# Altium schematic sheet pcb_clk.SchDoc
size 228 x 114 mm; SheetNumber: 4; SheetTotal: 13
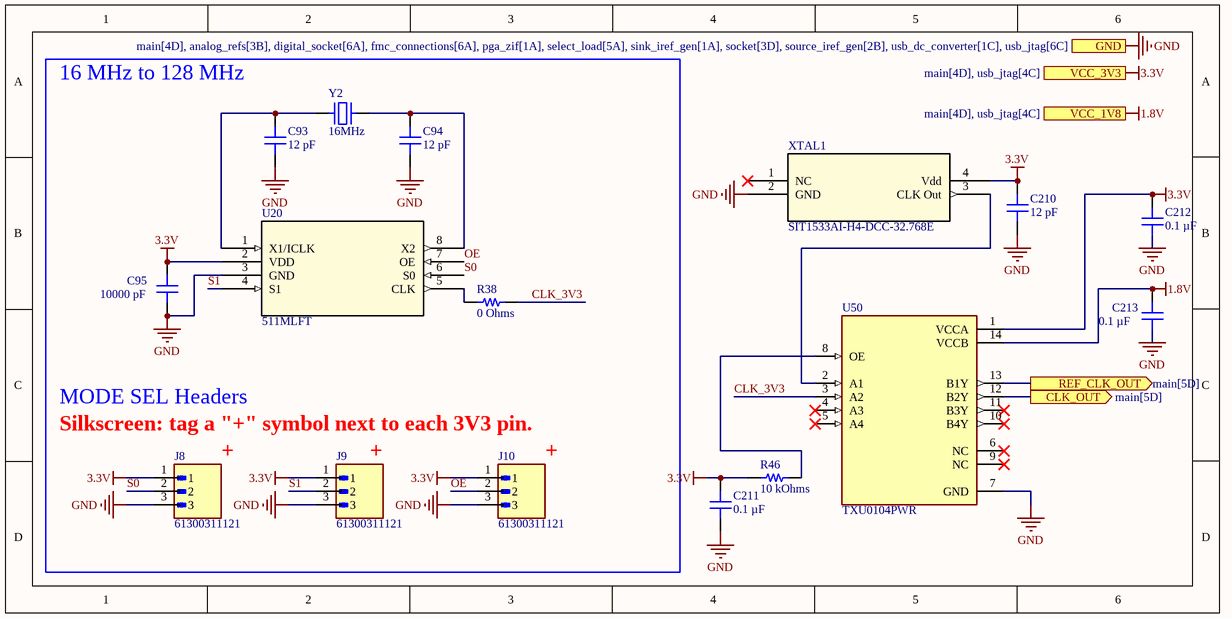
[diagram p0: pcb_clk.SchDoc]

## Parts
C93  12 pF  [CAP 0805_2012]
C94  12 pF  [CAP 0805_2012]
C95  10000 pF  [CAP 0805_2012]
C210  12 pF  [CAP 0805_2012]
C211  0.1 µF  [CAP 0805_2012]
C212  0.1 µF  [CAP 0805_2012]
C213  0.1 µF  [CAP 0805_2012]
J8  61300311121  [WURTH_61300311121]
J9  61300311121  [WURTH_61300311121]
J10  61300311121  [WURTH_61300311121]
R38  0 Ohms  [RES 0805_2012]
R46  10 kOhms  [RES 0805_2012]
U20  511MLFT  [SOIC8_150MIL_REN]
U50  TXU0104PWR  [SOP65P640X120-14N]
XTAL1  SIT1533AI-H4-DCC-32.768E  [XTAL4_SiT1533_SIT]
Y2  16MHz  [TXC 9C]

## Ports
CLK_OUT (out, see main[5D]), GND (see main[4D], analog_refs[3B], digital_socket[6A], fmc_connections[6A], pga_zif[1A], select_load[5A], sink_iref_gen[1A], socket[3D], source_iref_gen[2B], usb_dc_converter[1C], usb_jtag[6C]), REF_CLK_OUT (out, see main[5D]), VCC_1V8 (see main[4D], usb_jtag[4C]), VCC_3V3 (see main[4D], usb_jtag[4C])

## Nets
1.8V: C213.2 U50.14(VCCB) ; port VCC_1V8
3.3V: C95.2 C210.2 C211.2 C212.2 J8.1 J9.1 J10.1 R46.1 U20.2(VDD) U50.1(VCCA) XTAL1.4(Vdd) ; port VCC_3V3
GND: C93.1 C94.1 C95.1 C210.1 C211.1 C212.1 C213.1 J8.3 J9.3 J10.3 U20.3(GND) U50.7(GND) XTAL1.2(GND) ; port GND
CLK_3V3: R38.2 U50.3(A2)
CLK_OUT: U50.12(B2Y) ; port CLK_OUT
OE: J10.2 U20.7(OE)
REF_CLK_OUT: U50.13(B1Y) ; port REF_CLK_OUT
S0: J8.2 U20.6(S0)
S1: J9.2 U20.4(S1)
NetC93_2: C93.2 U20.1(X1/ICLK) Y2.1
NetC94_2: C94.2 U20.8(X2) Y2.2
NetR38_1: R38.1 U20.5(CLK)
NetR46_2: R46.2 U50.8(OE)
NetU50_2: U50.2(A1) XTAL1.3(CLK_Out)

Not connected (* = marked no-connect by the designer): U50 4(A3)* 5(A4)* 6(NC)* 9(NC)* 10(B4Y)* 11(B3Y)*; XTAL1 1(NC)*

## Notes on the sheet
- (near C93) 16 MHz to 128 MHz
- MODE SEL Headers
- Silkscreen: tag a "+" symbol next to each 3V3 pin.
- (near J8) +
- (near J9) +
- (near J10) +

## Library data of the parts
C93 C94 C210 = 251R15S120GV4E: CAP CER 12PF 250V NP0 0805; manufacturer: Johanson Technology Inc.; Temperature Coefficient: C0G, NP0; Tolerance: ±2%; Part Number: 251R15S120GV4E; Capacitance: 12 pF; Applications: RF, Microwave, High Frequency; componentlink1description: Datasheet; componentlink1url: https://www.johansontechnology.com/downloads/catalog/johanson-technology-multi-layer-high-q-capacitors.pdf; componentlink2description: DigiKey Link; componentlink2url: https://www.digikey.com/en/products/detail/johanson-technology-inc/251R15S120GV4E/1919438; Device Package: 0805 (2012 Metric); Features: High Q, Low Loss, Ultra Low ESR; lastupdated: 4/6/2026 7:32:26 PM; Lifecycle Status: Active; Minimum Order: 1; Mounting Type: Surface Mount, MLCC; Operating Temperature: -55°C ~ 125°C; Package / Case: 0805 (2012 Metric); packaging: TapeAndReel; partid: 16409; Part Status: Active; price: 0.13; series: S; Size / Dimension: 0.080" L x 0.050" W (2.03mm x 1.27mm); Supplier 1: DigiKey; Supplier Part Number 1: 712-1722-1-ND; Thickness (Max): 0.046" (1.17mm); value: 12 pF; Voltage - Rated: 250V
C95 = C0805C103F3GEC7800: CAP CER 0805 10NF 25V C0G 1%; manufacturer: KEMET; Temperature Coefficient: C0G, NP0; Part Number: C0805C103F3GEC7800; Capacitance: 10000 pF; Applications: ESD Protection; componentlink1description: Datasheet; componentlink1url: https://connect.kemet.com:7667/gateway/IntelliData-ComponentDocumentation/1.0/download/datasheet/C0805C103F3GEC7800; componentlink2description: DigiKey Link; componentlink2url: https://www.digikey.com/en/products/detail/kemet/C0805C103F3GEC7800/8644419; Device Package: 0805 (2012 Metric); Features: Low ESL, Low ESR; lastupdated: 4/6/2026 7:29:19 PM; Lifecycle Status: Active; Minimum Order: 1; Mounting Type: Surface Mount, MLCC; Operating Temperature: -55°C ~ 125°C; Package / Case: 0805 (2012 Metric); packaging: TapeAndReel; partid: 72904; price: 0.43; series: ESD SMD Comm C0G; Size / Dimension: 0.079" L x 0.049" W (2.00mm x 1.25mm); Supplier 1: DigiKey; Supplier Part Number 1: 399-C0805C103F3GEC7800CT-ND; Thickness (Max): 0.039" (1.00mm); Tolerance: ±1%; value: 10000 pF; Voltage - Rated: 25V
C211-C213 = 160R15W104KV4T: CAP CER 0.1UF 16V X7R 0805; manufacturer: Johanson Dielectrics Inc.; Tolerance: ±10%; Part Number: 160R15W104KV4T; Capacitance: 0.1 µF; Applications: General Purpose; componentlink1description: Datasheet; componentlink1url: https://www.johansondielectrics.com/downloads/catalog/johanson-dielectrics-product-catalog.pdf; componentlink2description: DigiKey Link; componentlink2url: https://www.digikey.com/en/products/detail/johanson-dielectrics-inc/160R15W104KV4T/1859428; Device Package: 0805 (2012 Metric); lastupdated: 4/6/2026 7:32:57 PM; Lifecycle Status: Active; Minimum Order: 1; Mounting Type: Surface Mount, MLCC; Operating Temperature: -55°C ~ 125°C; Package / Case: 0805 (2012 Metric); packaging: TapeAndReel; partid: 9125; Part Status: Active; price: 0.03; series: -; Size / Dimension: 0.080" L x 0.050" W (2.03mm x 1.27mm); Supplier 1: DigiKey; Supplier Part Number 1: 709-1183-1-ND; Temperature Coefficient: X7R; Thickness (Max): 0.050" (1.27mm); value: 0.1 µF; Voltage - Rated: 16V
R38 = 560112120002: RES 0 OHM JUMPER 0805; Manufacturer: Würth Elektronik; Part Number: 560112120002; Value: 0 Ohms; ComponentLink1Description: Datasheet; ComponentLink1URL: https://www.we-online.com/katalog/datasheet/560112120002.pdf; ComponentLink2Description: DigiKey Link; ComponentLink2URL: https://www.digikey.com/en/products/detail/würth-elektronik/560112120002/22230691; Composition: Thick Film; Device Package: 0805 (2012 Metric); Features: Anti-Sulfur; Height - Seated (Max): 0.026" (0.65mm); LastUpdated: 4/6/2026 8:09:42 PM; Lifecycle Status: Active; Minimum Order: 1; Number of Terminations: 2; Operating Temperature: -55°C ~ 155°C; Package / Case: 0805 (2012 Metric); Packaging: TapeAndReel; PartId: 95962; Price: 0.03; Resistance: 0 Ohms; Series: WRIS-RSKS; Size / Dimension: 0.079" L x 0.049" W (2.00mm x 1.25mm); Supplier 1: DigiKey; Supplier Part Number 1: 732-560112120002CT-ND; Supplier Device Package: 0805; Tolerance: Jumper
R46 = 3430A2F10KTDF: 3430 A2 1% 10K 100PPM 1K RL; Manufacturer: TE Connectivity Passive Product; Power (Watts): 1W; Temperature Coefficient: ±100ppm/°C; Part Number: 3430A2F10KTDF; Value: 10 kOhms; ComponentLink2Description: DigiKey Link; ComponentLink2URL: https://www.digikey.com/en/products/detail/te-connectivity-passive-product/3430A2F10KTDF/17764190; Composition: Thick Film; Device Package: 0805 (2012 Metric); Features: Automotive AEC-Q200; Height - Seated (Max): 0.026" (0.65mm); LastUpdated: 4/5/2026 8:08:30 PM; Lifecycle Status: Active; Minimum Order: 1; Number of Terminations: 2; Operating Temperature: -55°C ~ 155°C; Package / Case: 0805 (2012 Metric); Packaging: TapeAndReel; PartId: 77781; Part Status: Active; Price: 0.02; Ratings: AEC-Q200; Resistance: 10 kOhms; Series: 3430; Size / Dimension: 0.049" L x 0.079" W (1.25mm x 2.00mm); Supplier 1: DigiKey; Supplier Part Number 1: 1712-3430A2F10KTDFCT-ND; Supplier Device Package: 0508; Tolerance: ±1%
U20 = 511MLFT: No Description Available; Mfr_Name: Renesas Electronics; RefDes: RefDes; Type: Type
U50 = TXU0104PWR: Four channel unidirectional level shifter; MF: Texas Instruments; SnapEDA_Link: https://www.snapeda.com/parts/TXU0104PWR/Texas+Instruments/view-part/?ref=snap; Package: None; Value: *; MP: TXU0104PWR; Check_prices: https://www.snapeda.com/parts/TXU0104PWR/Texas+Instruments/view-part/?ref=eda
XTAL1 = SIT1533AI-H4-DCC-32.768E: Description; Manufacturer_Name: SiTime; Copyright: Copyright (C) 2025 Ultra Librarian. All rights reserved.; Manufacturer_Part_Number: SIT1533AI-H4-DCC-32.768E; RefDes: RefDes; Type: Type
Y2 = 9C-16.000MAAJ-T: CRYSTAL 16.0000MHZ 18PF SMD; Manufacturer: TXC CORPORATION; ESR (Equivalent Series Resistance): 30 Ohms; Frequency Stability: ±30ppm; Operating Mode: Fundamental; Part Number: 9C-16.000MAAJ-T; ComponentLink1Description: Datasheet; ComponentLink1URL: http://www.txccorp.com/download/products/quartz_crystals/2015TXC_9C_32.pdf; ComponentLink2Description: DigiKey Link; ComponentLink2URL: http://digikey.com/product-detail/en/txc-corporation/9C-16.000MAAJ-T/887-1059-1-ND/2118936; Frequency: 16MHz; Frequency Tolerance: ±30ppm; Height - Seated (Max): 0.161" (4.10mm); LastUpdated: 4/5/2026 8:41:30 PM; Lifecycle Status: Active; Load Capacitance: 18pF; Minimum Order: 1; Mounting Type: Surface Mount; Operating Temperature: -20°C ~ 70°C; Package / Case: HC-49/US; Packaging: TapeAndReel; PartId: 708; Part Status: Active; Price: 0.22; Series: 9C; Size / Dimension: 0.449" L x 0.189" W (11.40mm x 4.80mm); Supplier 1: DigiKey; Supplier Part Number 1: 887-1059-1-ND; Type: MHz Crystal; Value: 16MHz
J8-J10 = 61300311121: Package: None; Price: None; Value: *; MP: 61300311121; Availability: Unavailable